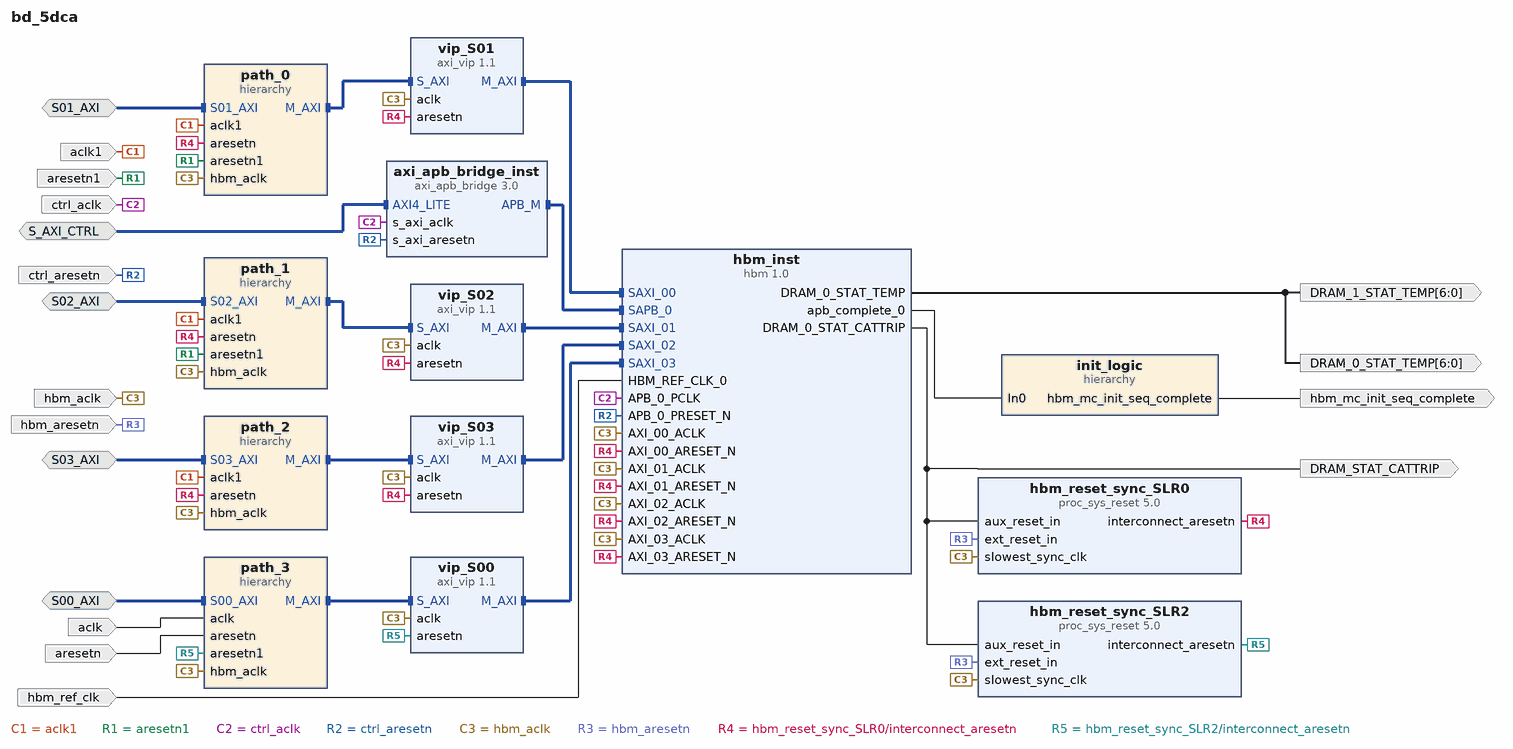
[diagram p0: block diagram of the top level]
# Vivado block design bd_5dca, xcu50-fsvh2104-2-e, Vivado 2022.1
create_bd_design bd_5dca

create_bd_intf_port -mode Slave -vlnv xilinx.com:interface:aximm_rtl:1.0 S_AXI_CTRL
set_property -dict {CONFIG.ADDR_WIDTH 22 CONFIG.PROTOCOL AXI4LITE} [get_bd_intf_ports S_AXI_CTRL]
create_bd_intf_port -mode Slave -vlnv xilinx.com:interface:aximm_rtl:1.0 S00_AXI
set_property -dict [list \
  CONFIG.ADDR_WIDTH 33 \
  CONFIG.DATA_WIDTH 512 \
  CONFIG.NUM_READ_OUTSTANDING 1 \
  CONFIG.NUM_WRITE_OUTSTANDING 1 \
  CONFIG.master_id 1 \
] [get_bd_intf_ports S00_AXI]
create_bd_intf_port -mode Slave -vlnv xilinx.com:interface:aximm_rtl:1.0 S01_AXI
set_property -dict [list \
  CONFIG.ADDR_WIDTH 28 \
  CONFIG.NUM_READ_OUTSTANDING 16 \
  CONFIG.NUM_WRITE_OUTSTANDING 16 \
  CONFIG.master_id 1 \
] [get_bd_intf_ports S01_AXI]
create_bd_intf_port -mode Slave -vlnv xilinx.com:interface:aximm_rtl:1.0 S02_AXI
set_property -dict [list \
  CONFIG.ADDR_WIDTH 28 \
  CONFIG.NUM_READ_OUTSTANDING 16 \
  CONFIG.NUM_WRITE_OUTSTANDING 16 \
  CONFIG.master_id 1 \
] [get_bd_intf_ports S02_AXI]
create_bd_intf_port -mode Slave -vlnv xilinx.com:interface:aximm_rtl:1.0 S03_AXI
set_property -dict [list \
  CONFIG.ADDR_WIDTH 28 \
  CONFIG.NUM_READ_OUTSTANDING 32 \
  CONFIG.NUM_WRITE_OUTSTANDING 32 \
  CONFIG.master_id 1 \
] [get_bd_intf_ports S03_AXI]
create_bd_port -dir I -type clk hbm_aclk
create_bd_port -dir I -type rst hbm_aresetn
set_property -dict {CONFIG.POLARITY ACTIVE_LOW} [get_bd_ports hbm_aresetn]
create_bd_port -dir I -type clk hbm_ref_clk
create_bd_port -dir O hbm_mc_init_seq_complete
create_bd_port -dir O -from 6 -to 0 DRAM_0_STAT_TEMP
create_bd_port -dir O -from 6 -to 0 DRAM_1_STAT_TEMP
create_bd_port -dir O -type intr DRAM_STAT_CATTRIP
create_bd_port -dir I -type clk ctrl_aclk
set_property -dict {CONFIG.ASSOCIATED_BUSIF S_AXI_CTRL CONFIG.ASSOCIATED_RESET ctrl_aresetn} [get_bd_ports ctrl_aclk]
create_bd_port -dir I -type rst ctrl_aresetn
set_property -dict {CONFIG.POLARITY ACTIVE_LOW} [get_bd_ports ctrl_aresetn]
create_bd_port -dir I -type clk aclk
set_property -dict {CONFIG.ASSOCIATED_BUSIF S00_AXI} [get_bd_ports aclk]
create_bd_port -dir I -type clk aclk1
set_property -dict {CONFIG.ASSOCIATED_BUSIF S01_AXI:S02_AXI:S03_AXI} [get_bd_ports aclk1]
create_bd_port -dir I -type rst aresetn
set_property -dict {CONFIG.POLARITY ACTIVE_LOW} [get_bd_ports aresetn]
create_bd_port -dir I -type rst aresetn1
set_property -dict {CONFIG.POLARITY ACTIVE_LOW} [get_bd_ports aresetn1]

create_bd_cell -type ip -vlnv xilinx.com:ip:hbm:1.0 hbm_inst
set_property -dict [list \
  CONFIG.USER_CLK_SEL_LIST0 AXI_03_ACLK \
  CONFIG.USER_DIS_REF_CLK_BUFG TRUE \
  CONFIG.USER_HBM_DENSITY 4GB \
  CONFIG.USER_HBM_STACK 1 \
  CONFIG.USER_INIT_TIMEOUT_VAL 0 \
  CONFIG.USER_MC0_ECC_SCRUB_PERIOD 0x0032 \
  CONFIG.USER_MC0_ENABLE_ECC_CORRECTION true \
  CONFIG.USER_MC0_ENABLE_ECC_SCRUBBING true \
  CONFIG.USER_MC0_TEMP_CTRL_SELF_REF_INTVL true \
  CONFIG.USER_MC10_ECC_SCRUB_PERIOD 0x0032 \
  CONFIG.USER_MC10_ENABLE_ECC_CORRECTION true \
  CONFIG.USER_MC10_ENABLE_ECC_SCRUBBING true \
  CONFIG.USER_MC10_INITILIZE_MEM_USING_ECC_SCRUB true \
  CONFIG.USER_MC10_TEMP_CTRL_SELF_REF_INTVL true \
  CONFIG.USER_MC11_ECC_SCRUB_PERIOD 0x0032 \
  CONFIG.USER_MC11_ENABLE_ECC_CORRECTION true \
  CONFIG.USER_MC11_ENABLE_ECC_SCRUBBING true \
  CONFIG.USER_MC11_INITILIZE_MEM_USING_ECC_SCRUB true \
  CONFIG.USER_MC11_TEMP_CTRL_SELF_REF_INTVL true \
  CONFIG.USER_MC12_ECC_SCRUB_PERIOD 0x0032 \
  CONFIG.USER_MC12_ENABLE_ECC_CORRECTION true \
  CONFIG.USER_MC12_ENABLE_ECC_SCRUBBING true \
  CONFIG.USER_MC12_INITILIZE_MEM_USING_ECC_SCRUB true \
  CONFIG.USER_MC12_TEMP_CTRL_SELF_REF_INTVL true \
  CONFIG.USER_MC13_ECC_SCRUB_PERIOD 0x0032 \
  CONFIG.USER_MC13_ENABLE_ECC_CORRECTION true \
  CONFIG.USER_MC13_ENABLE_ECC_SCRUBBING true \
  CONFIG.USER_MC13_INITILIZE_MEM_USING_ECC_SCRUB true \
  CONFIG.USER_MC13_TEMP_CTRL_SELF_REF_INTVL true \
  CONFIG.USER_MC14_ECC_SCRUB_PERIOD 0x0032 \
  CONFIG.USER_MC14_ENABLE_ECC_CORRECTION true \
  CONFIG.USER_MC14_ENABLE_ECC_SCRUBBING true \
  CONFIG.USER_MC14_INITILIZE_MEM_USING_ECC_SCRUB true \
  CONFIG.USER_MC14_TEMP_CTRL_SELF_REF_INTVL true \
  CONFIG.USER_MC15_ECC_SCRUB_PERIOD 0x0032 \
  CONFIG.USER_MC15_ENABLE_ECC_CORRECTION true \
  CONFIG.USER_MC15_ENABLE_ECC_SCRUBBING true \
  CONFIG.USER_MC15_INITILIZE_MEM_USING_ECC_SCRUB true \
  CONFIG.USER_MC15_TEMP_CTRL_SELF_REF_INTVL true \
  CONFIG.USER_MC1_ECC_SCRUB_PERIOD 0x0032 \
  CONFIG.USER_MC1_ENABLE_ECC_CORRECTION true \
  CONFIG.USER_MC1_ENABLE_ECC_SCRUBBING true \
  CONFIG.USER_MC1_INITILIZE_MEM_USING_ECC_SCRUB true \
  CONFIG.USER_MC1_TEMP_CTRL_SELF_REF_INTVL true \
  CONFIG.USER_MC2_ECC_SCRUB_PERIOD 0x0032 \
  CONFIG.USER_MC2_ENABLE_ECC_CORRECTION true \
  CONFIG.USER_MC2_ENABLE_ECC_SCRUBBING true \
  CONFIG.USER_MC2_INITILIZE_MEM_USING_ECC_SCRUB true \
  CONFIG.USER_MC2_TEMP_CTRL_SELF_REF_INTVL true \
  CONFIG.USER_MC3_ECC_SCRUB_PERIOD 0x0032 \
  CONFIG.USER_MC3_ENABLE_ECC_CORRECTION true \
  CONFIG.USER_MC3_ENABLE_ECC_SCRUBBING true \
  CONFIG.USER_MC3_INITILIZE_MEM_USING_ECC_SCRUB true \
  CONFIG.USER_MC3_TEMP_CTRL_SELF_REF_INTVL true \
  CONFIG.USER_MC4_ECC_SCRUB_PERIOD 0x0032 \
  CONFIG.USER_MC4_ENABLE_ECC_CORRECTION true \
  CONFIG.USER_MC4_ENABLE_ECC_SCRUBBING true \
  CONFIG.USER_MC4_INITILIZE_MEM_USING_ECC_SCRUB true \
  CONFIG.USER_MC4_TEMP_CTRL_SELF_REF_INTVL true \
  CONFIG.USER_MC5_ECC_SCRUB_PERIOD 0x0032 \
  CONFIG.USER_MC5_ENABLE_ECC_CORRECTION true \
  CONFIG.USER_MC5_ENABLE_ECC_SCRUBBING true \
  CONFIG.USER_MC5_INITILIZE_MEM_USING_ECC_SCRUB true \
  CONFIG.USER_MC5_TEMP_CTRL_SELF_REF_INTVL true \
  CONFIG.USER_MC6_ECC_SCRUB_PERIOD 0x0032 \
  CONFIG.USER_MC6_ENABLE_ECC_CORRECTION true \
  CONFIG.USER_MC6_ENABLE_ECC_SCRUBBING true \
  CONFIG.USER_MC6_INITILIZE_MEM_USING_ECC_SCRUB true \
  CONFIG.USER_MC6_TEMP_CTRL_SELF_REF_INTVL true \
  CONFIG.USER_MC7_ECC_SCRUB_PERIOD 0x0032 \
  CONFIG.USER_MC7_ENABLE_ECC_CORRECTION true \
  CONFIG.USER_MC7_ENABLE_ECC_SCRUBBING true \
  CONFIG.USER_MC7_INITILIZE_MEM_USING_ECC_SCRUB true \
  CONFIG.USER_MC7_TEMP_CTRL_SELF_REF_INTVL true \
  CONFIG.USER_MC8_ECC_SCRUB_PERIOD 0x0032 \
  CONFIG.USER_MC8_ENABLE_ECC_CORRECTION true \
  CONFIG.USER_MC8_ENABLE_ECC_SCRUBBING true \
  CONFIG.USER_MC8_INITILIZE_MEM_USING_ECC_SCRUB true \
  CONFIG.USER_MC8_TEMP_CTRL_SELF_REF_INTVL true \
  CONFIG.USER_MC9_ECC_SCRUB_PERIOD 0x0032 \
  CONFIG.USER_MC9_ENABLE_ECC_CORRECTION true \
  CONFIG.USER_MC9_ENABLE_ECC_SCRUBBING true \
  CONFIG.USER_MC9_INITILIZE_MEM_USING_ECC_SCRUB true \
  CONFIG.USER_MC9_TEMP_CTRL_SELF_REF_INTVL true \
  CONFIG.USER_MC_ENABLE_00 TRUE \
  CONFIG.USER_MC_ENABLE_01 FALSE \
  CONFIG.USER_MC_ENABLE_02 FALSE \
  CONFIG.USER_MC_ENABLE_03 FALSE \
  CONFIG.USER_MC_ENABLE_04 FALSE \
  CONFIG.USER_MC_ENABLE_05 FALSE \
  CONFIG.USER_MC_ENABLE_06 FALSE \
  CONFIG.USER_MC_ENABLE_07 FALSE \
  CONFIG.USER_MC_ENABLE_08 FALSE \
  CONFIG.USER_MC_ENABLE_09 FALSE \
  CONFIG.USER_MC_ENABLE_10 FALSE \
  CONFIG.USER_MC_ENABLE_11 FALSE \
  CONFIG.USER_MC_ENABLE_12 FALSE \
  CONFIG.USER_MC_ENABLE_13 FALSE \
  CONFIG.USER_MC_ENABLE_14 FALSE \
  CONFIG.USER_MC_ENABLE_15 FALSE \
  CONFIG.USER_SAXI_00 true \
  CONFIG.USER_SAXI_01 true \
  CONFIG.USER_SAXI_02 true \
  CONFIG.USER_SAXI_03 true \
  CONFIG.USER_SAXI_04 false \
  CONFIG.USER_SAXI_05 false \
  CONFIG.USER_SAXI_06 false \
  CONFIG.USER_SAXI_07 false \
  CONFIG.USER_SAXI_08 false \
  CONFIG.USER_SAXI_09 false \
  CONFIG.USER_SAXI_10 false \
  CONFIG.USER_SAXI_11 false \
  CONFIG.USER_SAXI_12 false \
  CONFIG.USER_SAXI_13 false \
  CONFIG.USER_SAXI_14 false \
  CONFIG.USER_SAXI_15 false \
  CONFIG.USER_SAXI_16 false \
  CONFIG.USER_SAXI_17 false \
  CONFIG.USER_SAXI_18 false \
  CONFIG.USER_SAXI_19 false \
  CONFIG.USER_SAXI_20 false \
  CONFIG.USER_SAXI_21 false \
  CONFIG.USER_SAXI_22 false \
  CONFIG.USER_SAXI_23 false \
  CONFIG.USER_SAXI_24 false \
  CONFIG.USER_SAXI_25 false \
  CONFIG.USER_SAXI_26 false \
  CONFIG.USER_SAXI_27 false \
  CONFIG.USER_SAXI_28 false \
  CONFIG.USER_SAXI_29 false \
  CONFIG.USER_SAXI_30 false \
  CONFIG.USER_SAXI_31 false \
  CONFIG.USER_XSDB_INTF_EN FALSE \
] [get_bd_cells hbm_inst]
create_bd_cell -type ip -vlnv xilinx.com:ip:proc_sys_reset:5.0 hbm_reset_sync_SLR0
set_property -dict {CONFIG.C_AUX_RESET_HIGH 1} [get_bd_cells hbm_reset_sync_SLR0]
create_bd_cell -type ip -vlnv xilinx.com:ip:proc_sys_reset:5.0 hbm_reset_sync_SLR2
set_property -dict {CONFIG.C_AUX_RESET_HIGH 1} [get_bd_cells hbm_reset_sync_SLR2]
create_bd_cell -type ip -vlnv xilinx.com:ip:axi_vip:1.1 vip_S01
create_bd_cell -type ip -vlnv xilinx.com:ip:axi_vip:1.1 vip_S02
create_bd_cell -type ip -vlnv xilinx.com:ip:axi_vip:1.1 vip_S03
create_bd_cell -type ip -vlnv xilinx.com:ip:axi_vip:1.1 vip_S00
create_bd_cell -type ip -vlnv xilinx.com:ip:axi_apb_bridge:3.0 axi_apb_bridge_inst
set_property -dict {CONFIG.C_APB_NUM_SLAVES 1 CONFIG.C_M_APB_PROTOCOL apb3} [get_bd_cells axi_apb_bridge_inst]
create_bd_cell -type hier path_0
create_bd_cell -type hier path_1
create_bd_cell -type hier path_2
create_bd_cell -type hier path_3
create_bd_cell -type hier init_logic

# ---- hierarchy /path_0 ----
current_bd_instance /path_0
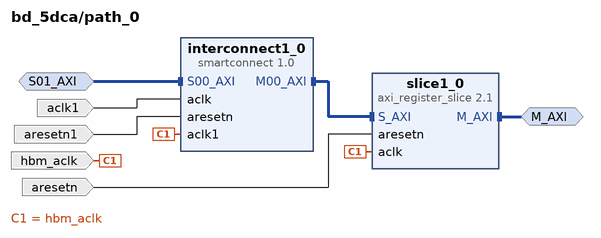
[diagram p1: block diagram inside /path_0]
create_bd_intf_pin -mode Slave -vlnv xilinx.com:interface:aximm_rtl:1.0 S01_AXI
create_bd_intf_pin -mode Master -vlnv xilinx.com:interface:aximm_rtl:1.0 M_AXI
create_bd_pin -dir I -type clk aclk1
create_bd_pin -dir I -type rst aresetn1
create_bd_pin -dir I -type clk hbm_aclk
create_bd_pin -dir I -type rst aresetn

create_bd_cell -type ip -vlnv xilinx.com:ip:smartconnect:1.0 interconnect1_0
set_property -dict [list \
  CONFIG.ADVANCED_PROPERTIES {__view__ {functional {S00_Entry {SUPPORTS_WRAP 0}} timing {S00_Entry {MMU_REGSLICE 1} M00_Exit {REGSLICE 1}}}} \
  CONFIG.NUM_CLKS 2 \
  CONFIG.NUM_SI 1 \
] [get_bd_cells interconnect1_0]
create_bd_cell -type ip -vlnv xilinx.com:ip:axi_register_slice:2.1 slice1_0
set_property -dict {CONFIG.REG_AR 7 CONFIG.REG_AW 7 CONFIG.REG_B 7 CONFIG.REG_R 1 CONFIG.REG_W 1} [get_bd_cells slice1_0]

# ---- hierarchy /path_1 ----
current_bd_instance /path_1
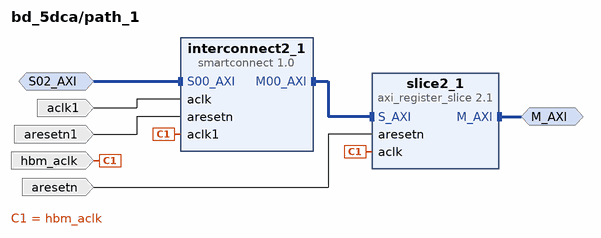
[diagram p2: block diagram inside /path_1]
create_bd_intf_pin -mode Slave -vlnv xilinx.com:interface:aximm_rtl:1.0 S02_AXI
create_bd_intf_pin -mode Master -vlnv xilinx.com:interface:aximm_rtl:1.0 M_AXI
create_bd_pin -dir I -type clk aclk1
create_bd_pin -dir I -type rst aresetn1
create_bd_pin -dir I -type clk hbm_aclk
create_bd_pin -dir I -type rst aresetn

create_bd_cell -type ip -vlnv xilinx.com:ip:smartconnect:1.0 interconnect2_1
set_property -dict [list \
  CONFIG.ADVANCED_PROPERTIES {__view__ {functional {S00_Entry {SUPPORTS_WRAP 0}} timing {S00_Entry {MMU_REGSLICE 1} M00_Exit {REGSLICE 1}}}} \
  CONFIG.NUM_CLKS 2 \
  CONFIG.NUM_SI 1 \
] [get_bd_cells interconnect2_1]
create_bd_cell -type ip -vlnv xilinx.com:ip:axi_register_slice:2.1 slice2_1
set_property -dict {CONFIG.REG_AR 7 CONFIG.REG_AW 7 CONFIG.REG_B 7 CONFIG.REG_R 1 CONFIG.REG_W 1} [get_bd_cells slice2_1]

# ---- hierarchy /path_2 ----
current_bd_instance /path_2
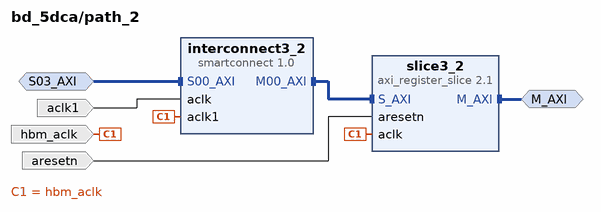
[diagram p3: block diagram inside /path_2]
create_bd_intf_pin -mode Slave -vlnv xilinx.com:interface:aximm_rtl:1.0 S03_AXI
create_bd_intf_pin -mode Master -vlnv xilinx.com:interface:aximm_rtl:1.0 M_AXI
create_bd_pin -dir I -type clk aclk1
create_bd_pin -dir I -type clk hbm_aclk
create_bd_pin -dir I -type rst aresetn

create_bd_cell -type ip -vlnv xilinx.com:ip:smartconnect:1.0 interconnect3_2
set_property -dict [list \
  CONFIG.ADVANCED_PROPERTIES {__view__ {functional {S00_Entry {SUPPORTS_WRAP 0}} timing {S00_Entry {MMU_REGSLICE 1} M00_Exit {REGSLICE 1}}}} \
  CONFIG.HAS_ARESETN 0 \
  CONFIG.NUM_CLKS 2 \
  CONFIG.NUM_SI 1 \
] [get_bd_cells interconnect3_2]
create_bd_cell -type ip -vlnv xilinx.com:ip:axi_register_slice:2.1 slice3_2
set_property -dict {CONFIG.REG_AR 7 CONFIG.REG_AW 7 CONFIG.REG_B 7 CONFIG.REG_R 1 CONFIG.REG_W 1} [get_bd_cells slice3_2]

# ---- hierarchy /path_3 ----
current_bd_instance /path_3
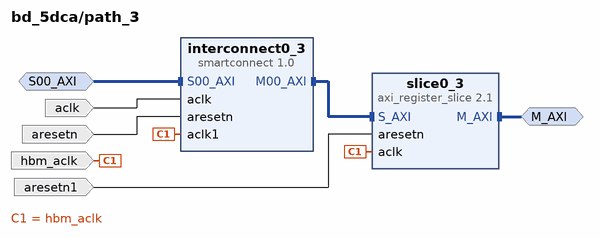
[diagram p4: block diagram inside /path_3]
create_bd_intf_pin -mode Slave -vlnv xilinx.com:interface:aximm_rtl:1.0 S00_AXI
create_bd_intf_pin -mode Master -vlnv xilinx.com:interface:aximm_rtl:1.0 M_AXI
create_bd_pin -dir I -type clk aclk
create_bd_pin -dir I -type rst aresetn
create_bd_pin -dir I -type clk hbm_aclk
create_bd_pin -dir I -type rst aresetn1

create_bd_cell -type ip -vlnv xilinx.com:ip:smartconnect:1.0 interconnect0_3
set_property -dict [list \
  CONFIG.ADVANCED_PROPERTIES {__view__ {functional {S00_Entry {SUPPORTS_WRAP 0}} timing {S00_Entry {MMU_REGSLICE 1} M00_Exit {REGSLICE 1}}}} \
  CONFIG.NUM_CLKS 2 \
  CONFIG.NUM_SI 1 \
] [get_bd_cells interconnect0_3]
create_bd_cell -type ip -vlnv xilinx.com:ip:axi_register_slice:2.1 slice0_3
set_property -dict [list \
  CONFIG.NUM_SLR_CROSSINGS 2 \
  CONFIG.PIPELINES_MASTER_AR 4 \
  CONFIG.PIPELINES_MASTER_AW 4 \
  CONFIG.PIPELINES_MASTER_B 4 \
  CONFIG.PIPELINES_MASTER_R 4 \
  CONFIG.PIPELINES_MASTER_W 4 \
  CONFIG.PIPELINES_MIDDLE_AR 4 \
  CONFIG.PIPELINES_MIDDLE_AW 4 \
  CONFIG.PIPELINES_MIDDLE_B 4 \
  CONFIG.PIPELINES_MIDDLE_R 4 \
  CONFIG.PIPELINES_MIDDLE_W 4 \
  CONFIG.PIPELINES_SLAVE_AR 4 \
  CONFIG.PIPELINES_SLAVE_AW 4 \
  CONFIG.PIPELINES_SLAVE_B 4 \
  CONFIG.PIPELINES_SLAVE_R 4 \
  CONFIG.PIPELINES_SLAVE_W 4 \
  CONFIG.REG_AR 15 \
  CONFIG.REG_AW 15 \
  CONFIG.REG_B 15 \
  CONFIG.REG_R 15 \
  CONFIG.REG_W 15 \
] [get_bd_cells slice0_3]

# ---- hierarchy /init_logic ----
current_bd_instance /init_logic
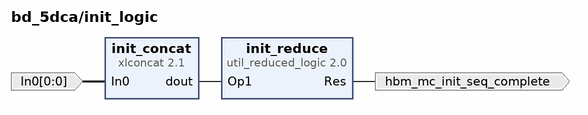
[diagram p5: block diagram inside /init_logic]
create_bd_pin -dir I -from 0 -to 0 In0
create_bd_pin -dir O hbm_mc_init_seq_complete

create_bd_cell -type ip -vlnv xilinx.com:ip:xlconcat:2.1 init_concat
set_property -dict {CONFIG.NUM_PORTS 1} [get_bd_cells init_concat]
create_bd_cell -type ip -vlnv xilinx.com:ip:util_reduced_logic:2.0 init_reduce
set_property -dict {CONFIG.C_OPERATION and CONFIG.C_SIZE 1} [get_bd_cells init_reduce]

# ---- connections ----

current_bd_instance /path_0
connect_bd_intf_net [get_bd_intf_pins S01_AXI] [get_bd_intf_pins interconnect1_0/S00_AXI]
connect_bd_intf_net [get_bd_intf_pins interconnect1_0/M00_AXI] [get_bd_intf_pins slice1_0/S_AXI]
connect_bd_intf_net [get_bd_intf_pins M_AXI] [get_bd_intf_pins slice1_0/M_AXI]
connect_bd_net -net aclk1_1 [get_bd_pins aclk1] [get_bd_pins interconnect1_0/aclk]
connect_bd_net -net aresetn1_1 [get_bd_pins aresetn1] [get_bd_pins interconnect1_0/aresetn]
connect_bd_net [get_bd_pins hbm_aclk] [get_bd_pins slice1_0/aclk] [get_bd_pins interconnect1_0/aclk1]
connect_bd_net -net hbm_reset_sync_SLR0_interconnect_aresetn [get_bd_pins aresetn] [get_bd_pins slice1_0/aresetn]

current_bd_instance /path_1
connect_bd_intf_net [get_bd_intf_pins S02_AXI] [get_bd_intf_pins interconnect2_1/S00_AXI]
connect_bd_intf_net [get_bd_intf_pins interconnect2_1/M00_AXI] [get_bd_intf_pins slice2_1/S_AXI]
connect_bd_intf_net [get_bd_intf_pins M_AXI] [get_bd_intf_pins slice2_1/M_AXI]
connect_bd_net -net aclk1_1 [get_bd_pins aclk1] [get_bd_pins interconnect2_1/aclk]
connect_bd_net -net aresetn1_1 [get_bd_pins aresetn1] [get_bd_pins interconnect2_1/aresetn]
connect_bd_net [get_bd_pins hbm_aclk] [get_bd_pins slice2_1/aclk] [get_bd_pins interconnect2_1/aclk1]
connect_bd_net -net hbm_reset_sync_SLR0_interconnect_aresetn [get_bd_pins aresetn] [get_bd_pins slice2_1/aresetn]

current_bd_instance /path_2
connect_bd_intf_net [get_bd_intf_pins S03_AXI] [get_bd_intf_pins interconnect3_2/S00_AXI]
connect_bd_intf_net [get_bd_intf_pins interconnect3_2/M00_AXI] [get_bd_intf_pins slice3_2/S_AXI]
connect_bd_intf_net [get_bd_intf_pins M_AXI] [get_bd_intf_pins slice3_2/M_AXI]
connect_bd_net -net aclk1_1 [get_bd_pins aclk1] [get_bd_pins interconnect3_2/aclk]
connect_bd_net [get_bd_pins hbm_aclk] [get_bd_pins slice3_2/aclk] [get_bd_pins interconnect3_2/aclk1]
connect_bd_net -net hbm_reset_sync_SLR0_interconnect_aresetn [get_bd_pins aresetn] [get_bd_pins slice3_2/aresetn]

current_bd_instance /path_3
connect_bd_intf_net [get_bd_intf_pins S00_AXI] [get_bd_intf_pins interconnect0_3/S00_AXI]
connect_bd_intf_net [get_bd_intf_pins interconnect0_3/M00_AXI] [get_bd_intf_pins slice0_3/S_AXI]
connect_bd_intf_net [get_bd_intf_pins M_AXI] [get_bd_intf_pins slice0_3/M_AXI]
connect_bd_net [get_bd_pins aclk] [get_bd_pins interconnect0_3/aclk]
connect_bd_net [get_bd_pins aresetn] [get_bd_pins interconnect0_3/aresetn]
connect_bd_net [get_bd_pins hbm_aclk] [get_bd_pins slice0_3/aclk] [get_bd_pins interconnect0_3/aclk1]
connect_bd_net -net hbm_reset_sync_SLR2_interconnect_aresetn [get_bd_pins aresetn1] [get_bd_pins slice0_3/aresetn]

current_bd_instance /init_logic
connect_bd_net -net hbm_inst_apb_complete_0 [get_bd_pins In0] [get_bd_pins init_concat/In0]
connect_bd_net [get_bd_pins init_concat/dout] [get_bd_pins init_reduce/Op1]
connect_bd_net [get_bd_pins init_reduce/Res] [get_bd_pins hbm_mc_init_seq_complete]

current_bd_instance /
connect_bd_intf_net [get_bd_intf_ports S00_AXI] [get_bd_intf_pins path_3/S00_AXI]
connect_bd_intf_net [get_bd_intf_ports S01_AXI] [get_bd_intf_pins path_0/S01_AXI]
connect_bd_intf_net [get_bd_intf_ports S02_AXI] [get_bd_intf_pins path_1/S02_AXI]
connect_bd_intf_net [get_bd_intf_ports S03_AXI] [get_bd_intf_pins path_2/S03_AXI]
connect_bd_intf_net [get_bd_intf_ports S_AXI_CTRL] [get_bd_intf_pins axi_apb_bridge_inst/AXI4_LITE]
connect_bd_intf_net [get_bd_intf_pins axi_apb_bridge_inst/APB_M] [get_bd_intf_pins hbm_inst/SAPB_0]
connect_bd_intf_net -intf_net slice0_3_M_AXI [get_bd_intf_pins path_3/M_AXI] [get_bd_intf_pins vip_S00/S_AXI]
connect_bd_intf_net -intf_net slice1_0_M_AXI [get_bd_intf_pins path_0/M_AXI] [get_bd_intf_pins vip_S01/S_AXI]
connect_bd_intf_net -intf_net slice2_1_M_AXI [get_bd_intf_pins path_1/M_AXI] [get_bd_intf_pins vip_S02/S_AXI]
connect_bd_intf_net -intf_net slice3_2_M_AXI [get_bd_intf_pins path_2/M_AXI] [get_bd_intf_pins vip_S03/S_AXI]
connect_bd_intf_net [get_bd_intf_pins vip_S00/M_AXI] [get_bd_intf_pins hbm_inst/SAXI_03]
connect_bd_intf_net [get_bd_intf_pins vip_S01/M_AXI] [get_bd_intf_pins hbm_inst/SAXI_00]
connect_bd_intf_net [get_bd_intf_pins vip_S02/M_AXI] [get_bd_intf_pins hbm_inst/SAXI_01]
connect_bd_intf_net [get_bd_intf_pins vip_S03/M_AXI] [get_bd_intf_pins hbm_inst/SAXI_02]
connect_bd_net -net aclk1_1 [get_bd_ports aclk1] [get_bd_pins path_0/aclk1] [get_bd_pins path_1/aclk1] [get_bd_pins path_2/aclk1]
connect_bd_net [get_bd_ports aclk] [get_bd_pins path_3/aclk]
connect_bd_net -net aresetn1_1 [get_bd_ports aresetn1] [get_bd_pins path_0/aresetn1] [get_bd_pins path_1/aresetn1]
connect_bd_net [get_bd_ports aresetn] [get_bd_pins path_3/aresetn]
connect_bd_net -net cattrip_net [get_bd_pins hbm_inst/DRAM_0_STAT_CATTRIP] \
  [get_bd_pins hbm_reset_sync_SLR0/aux_reset_in] [get_bd_pins hbm_reset_sync_SLR2/aux_reset_in] \
  [get_bd_ports DRAM_STAT_CATTRIP]
connect_bd_net [get_bd_ports ctrl_aclk] [get_bd_pins axi_apb_bridge_inst/s_axi_aclk] [get_bd_pins hbm_inst/APB_0_PCLK]
connect_bd_net [get_bd_ports ctrl_aresetn] [get_bd_pins axi_apb_bridge_inst/s_axi_aresetn] [get_bd_pins hbm_inst/APB_0_PRESET_N]
connect_bd_net [get_bd_ports hbm_aclk] \
  [get_bd_pins hbm_reset_sync_SLR0/slowest_sync_clk] [get_bd_pins hbm_reset_sync_SLR2/slowest_sync_clk] \
  [get_bd_pins vip_S01/aclk] [get_bd_pins hbm_inst/AXI_00_ACLK] [get_bd_pins vip_S02/aclk] [get_bd_pins hbm_inst/AXI_01_ACLK] \
  [get_bd_pins vip_S03/aclk] [get_bd_pins hbm_inst/AXI_02_ACLK] [get_bd_pins vip_S00/aclk] [get_bd_pins hbm_inst/AXI_03_ACLK] \
  [get_bd_pins path_0/hbm_aclk] [get_bd_pins path_1/hbm_aclk] [get_bd_pins path_2/hbm_aclk] [get_bd_pins path_3/hbm_aclk]
connect_bd_net [get_bd_ports hbm_aresetn] [get_bd_pins hbm_reset_sync_SLR0/ext_reset_in] [get_bd_pins hbm_reset_sync_SLR2/ext_reset_in]
connect_bd_net [get_bd_pins hbm_inst/DRAM_0_STAT_TEMP] [get_bd_ports DRAM_0_STAT_TEMP] [get_bd_ports DRAM_1_STAT_TEMP]
connect_bd_net [get_bd_pins hbm_inst/apb_complete_0] [get_bd_pins init_logic/In0]
connect_bd_net [get_bd_ports hbm_ref_clk] [get_bd_pins hbm_inst/HBM_REF_CLK_0]
connect_bd_net [get_bd_pins hbm_reset_sync_SLR0/interconnect_aresetn] \
  [get_bd_pins vip_S01/aresetn] [get_bd_pins hbm_inst/AXI_00_ARESET_N] [get_bd_pins vip_S02/aresetn] \
  [get_bd_pins hbm_inst/AXI_01_ARESET_N] [get_bd_pins vip_S03/aresetn] [get_bd_pins hbm_inst/AXI_02_ARESET_N] \
  [get_bd_pins hbm_inst/AXI_03_ARESET_N] [get_bd_pins path_0/aresetn] [get_bd_pins path_1/aresetn] \
  [get_bd_pins path_2/aresetn]
connect_bd_net [get_bd_pins hbm_reset_sync_SLR2/interconnect_aresetn] [get_bd_pins vip_S00/aresetn] [get_bd_pins path_3/aresetn1]
connect_bd_net -net init_reduce_Res [get_bd_pins init_logic/hbm_mc_init_seq_complete] [get_bd_ports hbm_mc_init_seq_complete]

# ---- address map ----
assign_bd_address -offset 0x000000000 -range 256M -target_address_space [get_bd_addr_spaces S00_AXI] [get_bd_addr_segs hbm_inst/SAXI_03/HBM_MEM00]
assign_bd_address -offset 0x0000000 -range 256M -target_address_space [get_bd_addr_spaces S01_AXI] [get_bd_addr_segs hbm_inst/SAXI_00/HBM_MEM00]
assign_bd_address -offset 0x0000000 -range 256M -target_address_space [get_bd_addr_spaces S02_AXI] [get_bd_addr_segs hbm_inst/SAXI_01/HBM_MEM00]
assign_bd_address -offset 0x0000000 -range 256M -target_address_space [get_bd_addr_spaces S03_AXI] [get_bd_addr_segs hbm_inst/SAXI_02/HBM_MEM00]
assign_bd_address -offset 0x000000 -range 4M -target_address_space [get_bd_addr_spaces S_AXI_CTRL] [get_bd_addr_segs hbm_inst/SAPB_0/Reg]

validate_bd_design
save_bd_design
